# EAGLE schematic CrowPanel ESP32 Display 1.28(R) Inch_V1.0_240507 (EAGLE 9.5.1)
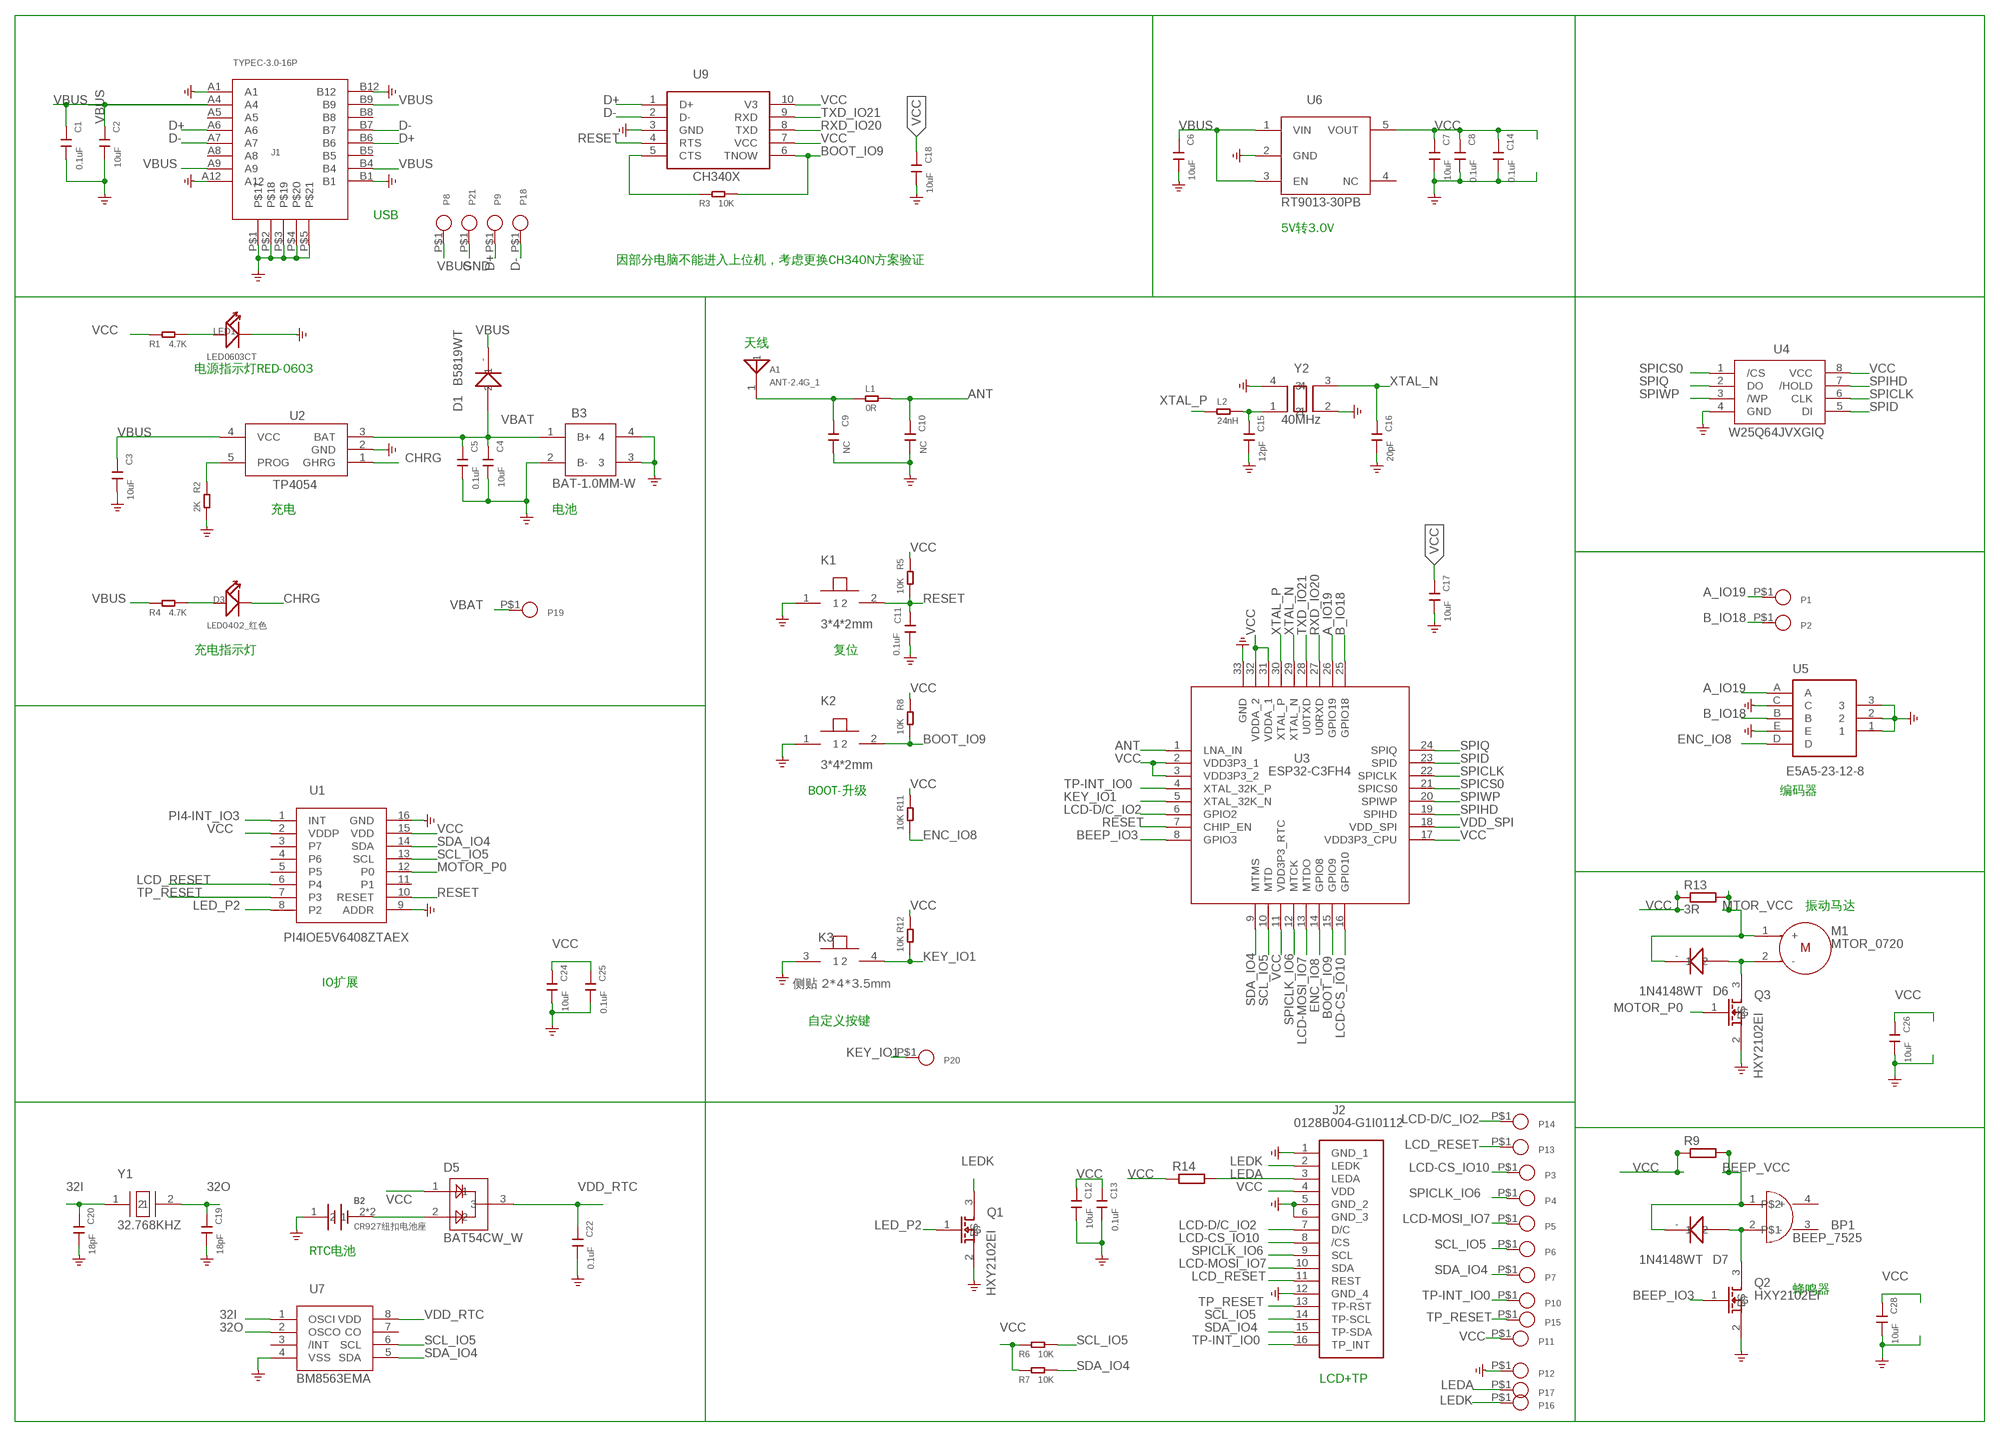
[diagram p0: schematic, sheet 1]

## Parts
A1  ANT-2.4G_1  [ANT-2.4G_1]
B2  CR927纽扣电池座  POWER-BAT  [POWER-BAT]
B3  BAT-1.0MM-W  [SH1.0MM-W]
BP1  BEEP_7525  [BEEP_7525]
C1  0.1uF  C0402  [0201_W]
C2  10uF  C0402_W  [0402]
C3  10uF  C0402_W  [0402]
C4  10uF  C0402_W  [0402]
C5  0.1uF  C0402  [0201_W]
C6  10uF  C0402_W  [0402]
C7  10uF  C0402_W  [0402]
C8  0.1uF  C0402  [0201_W]
C9  NC  C0402  [0201_W]
C10  NC  C0402  [0201_W]
C11  0.1uF  C0402  [0201_W]
C12  10uF  C0402_W  [0402]
C13  0.1uF  C0402  [0201_W]
C14  0.1uF  C0402  [0201_W]
C15  12pF  C0402  [0201_W]
C16  20pF  C0402  [0201_W]
C17  10uF  C0402_W  [0402]
C18  10uF  C0402_W  [0402]
C19  18pF  C0402  [0201_W]
C20  18pF  C0402  [0201_W]
C22  0.1uF  C0402  [0201_W]
C24  10uF  C0402_W  [0402]
C25  0.1uF  C0402  [0201_W]
C26  10uF  C0402_W  [0402]
C28  10uF  C0402_W  [0402]
D1  B5819WT  DIODE_W  [SOD-523]
D3  LED0402_红色  LED0402_W  [LED-0402_W]
D5  BAT54CW_W  [SOT-323_W]
D6  1N4148WT  DIODE_W  [SOD-523]
D7  1N4148WT  DIODE_W  [SOD-523]
J1  TYPEC-3.0-16P  KEVIN_TYPEC-3.0-16P-SMD  [KEVIN_3.0TYPEC-SMD]
J2  0128B004-G1I0112  [16PIN-SMD]
K1  3*4*2mm  KEY_3X4_W  [KEY-3X4_W]
K2  3*4*2mm  KEY_3X4_W  [KEY-3X4_W]
K3  侧贴 2*4*3.5mm  KEY_2X4X3.5_W  [KEY-3.5X4.5_C]
L1  0R  R0402  [0201_W]
L2  24nH  R0402  [0201_W]
LED1  LED0603CT  [LED-0603-CE]
M1  MTOR_0720  [MOTOR-1]
P1  PADPAD-1.0MM  [PAD-1.0MM]
P2  PADPAD-1.0MM  [PAD-1.0MM]
P3  PADPAD-1.0MM  [PAD-1.0MM]
P4  PADPAD-1.0MM  [PAD-1.0MM]
P5  PADPAD-1.0MM  [PAD-1.0MM]
P6  PADPAD-1.0MM  [PAD-1.0MM]
P7  PADPAD-1.0MM  [PAD-1.0MM]
P8  PADPAD-1.0MM  [PAD-1.0MM]
P9  PADPAD-1.0MM  [PAD-1.0MM]
P10  PADPAD-1.0MM  [PAD-1.0MM]
P11  PADPAD-1.0MM  [PAD-1.0MM]
P12  PADPAD-1.0MM  [PAD-1.0MM]
P13  PADPAD-1.0MM  [PAD-1.0MM]
P14  PADPAD-1.0MM  [PAD-1.0MM]
P15  PADPAD-1.0MM  [PAD-1.0MM]
P16  PADPAD-1.0MM  [PAD-1.0MM]
P17  PADPAD-1.0MM  [PAD-1.0MM]
P18  PADPAD-1.0MM  [PAD-1.0MM]
P19  PADPAD-1.0MM  [PAD-1.0MM]
P20  PADPAD-1.0MM  [PAD-1.0MM]
P21  PADPAD-1.0MM  [PAD-1.0MM]
Q1  HXY2102EI  [SOT-323_W]
Q2  HXY2102EI  [SOT-323_W]
Q3  HXY2102EI  [SOT-323_W]
R1  4.7K  R0402  [0201_W]
R2  2K  R0402  [0201_W]
R3  10K  R0402  [0201_W]
R4  4.7K  R0402  [0201_W]
R5  10K  R0402  [0201_W]
R6  10K  R0402  [0201_W]
R7  10K  R0402  [0201_W]
R8  10K  R0402  [0201_W]
R9  R-EU_R0402  [R0402]
R11  10K  R0402  [0201_W]
R12  10K  R0402  [0201_W]
R13  3R  R-EU_R0402  [R0402]
R14  R-EU_R0402  [R0402]
U1  PI4IOE5V6408ZTAEX  [UQFN-16]
U2  TP4054  4054A  [SOP23-5]
U3  ESP32-C3FH4  ESP32-C3  [QFN-32_W]
U4  W25Q64JVXGIQ  [XSON4X4]
U5  E5A5-23-12-8  [E5A5-23-12-8]
U6  RT9013-30PB  RT9013  [SOT23-5_W]
U7  BM8563EMA  [MSOP-8_W]
U9  CH340X  CH340E  [MSOP-10_W]
Y1  32.768KHZ  [3215_W]
Y2  40MHz  3225_W  [3225_W]

## Nets
32I: C20.1 U7.1(OSCI) Y1.1
32O: C19.1 U7.2(OSCO) Y1.2
A_IO19: P1.P$1 U3.26(GPIO19) U5.A
ANT: C10.1 L1.2 U3.1(LNA_IN)
B_IO18: P2.P$1 U3.25(GPIO18) U5.B
BEEP_IO3: Q2.1(G) U3.8(GPIO3)
BEEP_VCC: BP1.1(+) D7.- R9.2
BOOT_IO9: K2.2 R3.2 R8.2 U3.15(GPIO9) U9.6(TNOW)
CHRG: D3.2(-) U2.1(GHRG)
D+: J1.A6 J1.B6 P9.P$1 U9.1(D+)
D-: J1.A7 J1.B7 P18.P$1 U9.2(D-)
ENC_IO8: R11.2 U3.14(GPIO8) U5.D
GND: B2.1 B3.2(B-) B3.3 B3.4 C1.2 C2.2 C3.2 C4.2 C5.2 C6.2 C7.2 C8.2 C9.2 C10.2 C11.2 C12.2 C13.2 C14.2 C15.2 C16.2 C17.2 C18.2 C19.2 C20.2 C22.2 C24.2 C25.2 C26.2 C28.2 J1.A1 J1.A12 J1.B1 J1.B12 J1.P$1 J1.P$2 J1.P$3 J1.P$4 J1.P$5 J2.1(GND_1) J2.5(GND_2) J2.6(GND_3) J2.12(GND_4) K1.1 K2.1 K3.3 LED1.2(-) P12.P$1 P21.P$1 Q1.2(S) Q2.2(S) Q3.2(S) R2.2 U1.9(ADDR) U1.16(GND) U2.2(GND) U3.33(GND) U4.4(GND) U5.1 U5.2 U5.3 U5.C U5.E U6.2(GND) U7.4(VSS) U9.3(GND) Y2.2 Y2.4
KEY_IO1: K3.4 P20.P$1 R12.2 U3.5(XTAL_32K_N)
LCD-CS_IO10: J2.8(/CS) P3.P$1 U3.16(GPIO10)
LCD-D/C_IO2: J2.7(D/C) P14.P$1 U3.6(GPIO2)
LCD-MOSI_IO7: J2.10(SDA) P5.P$1 U3.13(MTDO)
LCD_RESET: J2.11(REST) P13.P$1 U1.6(P4)
LED_P2: Q1.1(G) U1.8(P2)
LEDA: J2.3(LEDA) P17.P$1 R14.2
LEDK: J2.2(LEDK) P16.P$1 Q1.3(D)
MOTOR_P0: Q3.1(G) U1.12(P0)
MTOR_VCC: D6.- M1.1(+) R13.2
N$2: LED1.1(+) R1.2
N$3: R2.1 U2.5(PROG)
N$4: C15.1 L2.2 Y2.1
N$5: R3.1 U9.5(CTS)
N$6: D3.1(+) R4.2
N$7: BP1.2(-) D7.+ Q2.3(D)
N$8: D6.+ M1.2(-) Q3.3(D)
N$9: A1.1 C9.1 L1.1
N$10: B2.2 B2.3 D5.2
PI4-INT_IO3: U1.1(INT)
RESET: C11.1 K1.2 R5.2 U1.10(RESET) U3.7(CHIP_EN) U9.4(RTS)
RXD_IO20: U3.27(U0RXD) U9.8(TXD)
SCL_IO5: J2.14(TP-SCL) P6.P$1 R6.2 U1.13(SCL) U3.10(MTD) U7.6(SCL)
SDA_IO4: J2.15(TP-SDA) P7.P$1 R7.2 U1.14(SDA) U3.9(MTMS) U7.5(SDA)
SPICLK: U3.22(SPICLK) U4.6(CLK)
SPICLK_IO6: J2.9(SCL) P4.P$1 U3.12(MTCK)
SPICS0: U3.21(SPICS0) U4.1(/CS)
SPID: U3.23(SPID) U4.5(DI)
SPIHD: U3.19(SPIHD) U4.7(/HOLD)
SPIQ: U3.24(SPIQ) U4.2(DO)
SPIWP: U3.20(SPIWP) U4.3(/WP)
TP-INT_IO0: J2.16(TP_INT) P10.P$1 U3.4(XTAL_32K_P)
TP_RESET: J2.13(TP-RST) P15.P$1 U1.7(P3)
TXD_IO21: U3.28(U0TXD) U9.9(RXD)
VBAT: B3.1(B+) C4.1 C5.1 D1.+ P19.P$1 U2.3(BAT)
VBUS: C1.1 C2.1 C3.1 C6.1 D1.- J1.A4 J1.A9 J1.B4 J1.B9 P8.P$1 R4.1 U2.4(VCC) U6.1(VIN) U6.3(EN)
VCC: C7.1 C8.1 C12.1 C13.1 C14.1 C17.1 C18.1 C24.1 C25.1 C26.1 C28.1 D5.1 J2.4(VDD) P11.P$1 R1.1 R5.1 R6.1 R7.1 R8.1 R9.1 R11.1 R12.1 R13.1 R14.1 U1.2(VDDP) U1.15(VDD) U3.2(VDD3P3_1) U3.3(VDD3P3_2) U3.11(VDD3P3_RTC) U3.17(VDD3P3_CPU) U3.31(VDDA_1) U3.32(VDDA_2) U4.8(VCC) U6.5(VOUT) U9.7(VCC) U9.10(V3)
VDD_RTC: C22.1 D5.3 U7.8(VDD)
VDD_SPI: U3.18(VDD_SPI)
XTAL_N: C16.1 U3.29(XTAL_N) Y2.3
XTAL_P: L2.1 U3.30(XTAL_P)
Unconnected: BP1.3 BP1.4 J1.A5 J1.A8 J1.B5 J1.B8 U1.3(P7) U1.4(P6) U1.5 U1.11(P1) U6.4(NC) U7.3(/INT) U7.7(CO)

## Notes on the sheet
- USB
- 5V转3.0V
- 因部分电脑不能进入上位机，考虑更换CH340N方案验证
- 天线
- 电源指示灯RED-0603
- 充电 | 电池
- 充电指示灯 | 复位
- BOOT-升级 | 编码器
- 振动马达
- IO扩展
- 自定义按键
- RTC电池
- 蜂鸣器
- LCD+TP

## Library data of the parts
A1 = WGH:ANT-2.4G_1
B2 = rcl:POWER-BAT
B3 = WGH:BAT-1.0MM-W
BP1 = WGH:BEEP_7525
C1 C5 C8-C11 C13-C16 C19 C20 C22 C25 = WGH:C0402
C2-C4 C6 C7 C12 C17 C18 C24 C26 C28 = WGH:C0402_W
D1 D6 D7 = WGH:DIODE_W
D3 = WGH:LED0402_W
D5 = WGH:BAT54CW_W
J1 = untitled:KEVIN_TYPEC-3.0-16P-SMD
J2 = WGH:0128B004-G1I0112
K1 K2 = WGH:KEY_3X4_W
K3 = WGH:KEY_2X4X3.5_W
L1 L2 R1-R8 R11 R12 = WGH:R0402
LED1 = rcl:LED0603CT
M1 = WGH:MTOR_0720
P1-P21 = crowpi_pow:PAD*
Q1-Q3 = WGH:HXY2102EI
R9 R13 R14 = rcl:R-EU_: RESISTOR, European symbol; SPICEPREFIX: R
U1 = WGH:PI4IOE5V6408ZTAEX
U2 = DFN8:4054A
U3 = WGH:ESP32-C3
U4 = WGH:W25Q64JVXGIQ
U5 = WGH:E5A5-23-12-8; SPICEPREFIX: X
U6 = WGH:RT9013
U7 = WGH:BM8563EMA
U9 = WGH:CH340E
Y1 = WGH:32.768KHZ
Y2 = WGH:3225_W